# EAGLE design 404_led_matrix (EAGLE 9.6.2)
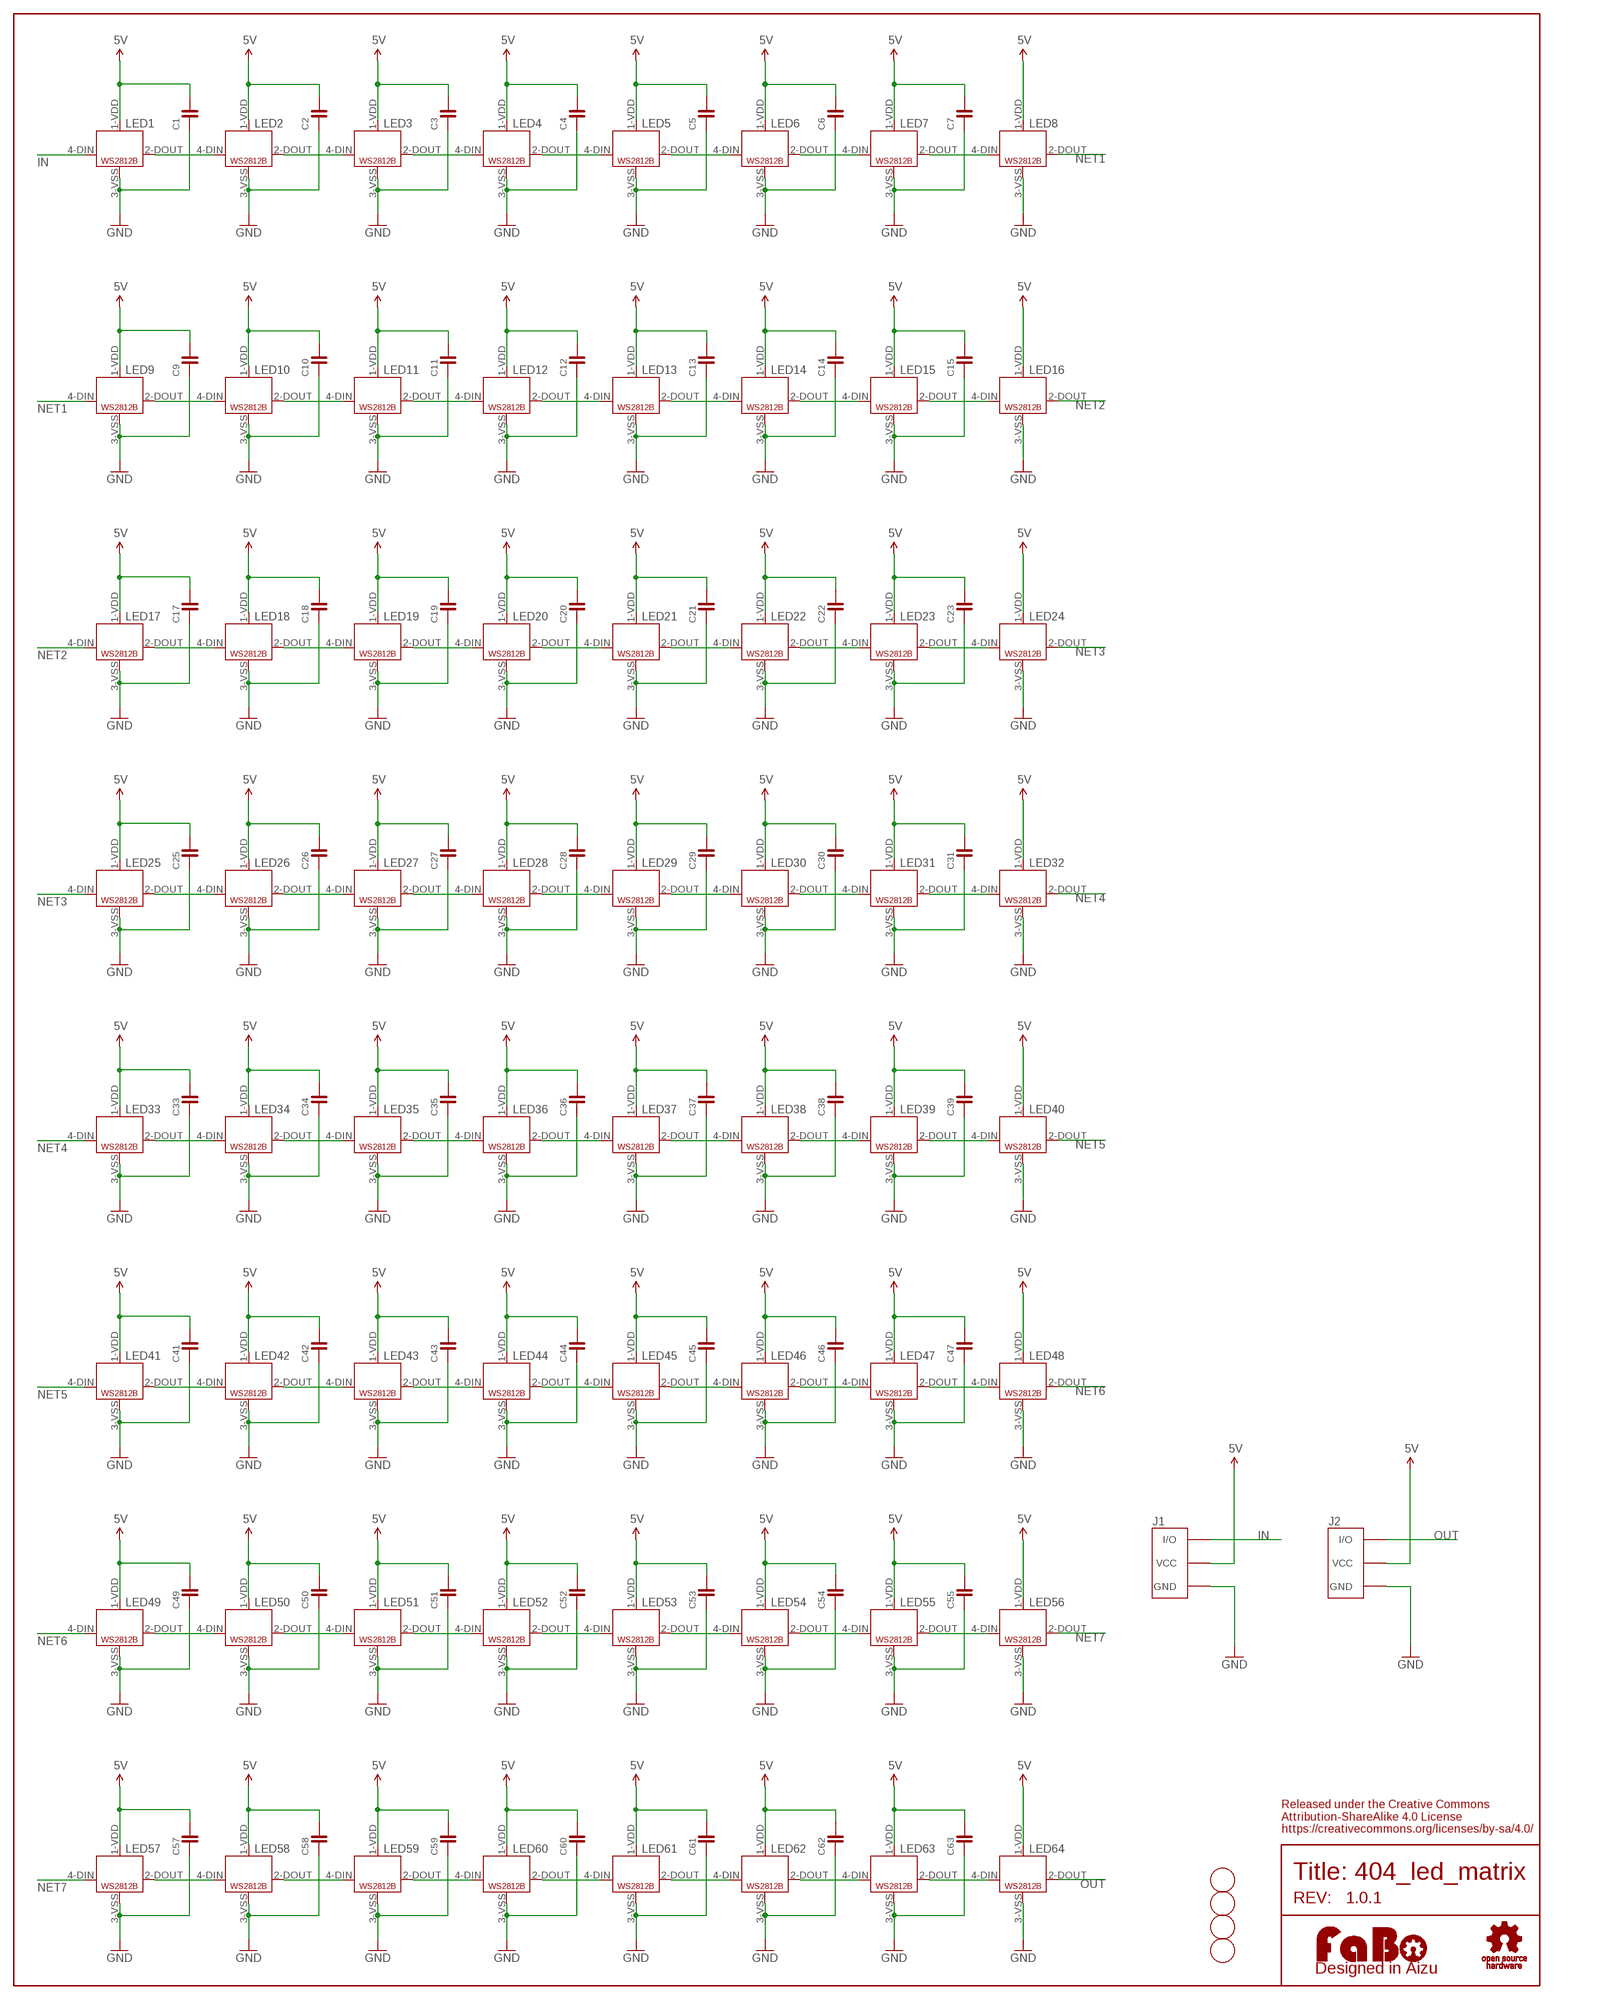
[diagram p0: schematic, sheet 1]

## Parts
C1  CAPACITOR-0603  [0603]
C2  CAPACITOR-0603  [0603]
C3  CAPACITOR-0603  [0603]
C4  CAPACITOR-0603  [0603]
C5  CAPACITOR-0603  [0603]
C6  CAPACITOR-0603  [0603]
C7  CAPACITOR-0603  [0603]
C9  CAPACITOR-0603  [0603]
C10  CAPACITOR-0603  [0603]
C11  CAPACITOR-0603  [0603]
C12  CAPACITOR-0603  [0603]
C13  CAPACITOR-0603  [0603]
C14  CAPACITOR-0603  [0603]
C15  CAPACITOR-0603  [0603]
C17  CAPACITOR-0603  [0603]
C18  CAPACITOR-0603  [0603]
C19  CAPACITOR-0603  [0603]
C20  CAPACITOR-0603  [0603]
C21  CAPACITOR-0603  [0603]
C22  CAPACITOR-0603  [0603]
C23  CAPACITOR-0603  [0603]
C25  CAPACITOR-0603  [0603]
C26  CAPACITOR-0603  [0603]
C27  CAPACITOR-0603  [0603]
C28  CAPACITOR-0603  [0603]
C29  CAPACITOR-0603  [0603]
C30  CAPACITOR-0603  [0603]
C31  CAPACITOR-0603  [0603]
C33  CAPACITOR-0603  [0603]
C34  CAPACITOR-0603  [0603]
C35  CAPACITOR-0603  [0603]
C36  CAPACITOR-0603  [0603]
C37  CAPACITOR-0603  [0603]
C38  CAPACITOR-0603  [0603]
C39  CAPACITOR-0603  [0603]
C41  CAPACITOR-0603  [0603]
C42  CAPACITOR-0603  [0603]
C43  CAPACITOR-0603  [0603]
C44  CAPACITOR-0603  [0603]
C45  CAPACITOR-0603  [0603]
C46  CAPACITOR-0603  [0603]
C47  CAPACITOR-0603  [0603]
C49  CAPACITOR-0603  [0603]
C50  CAPACITOR-0603  [0603]
C51  CAPACITOR-0603  [0603]
C52  CAPACITOR-0603  [0603]
C53  CAPACITOR-0603  [0603]
C54  CAPACITOR-0603  [0603]
C55  CAPACITOR-0603  [0603]
C57  CAPACITOR-0603  [0603]
C58  CAPACITOR-0603  [0603]
C59  CAPACITOR-0603  [0603]
C60  CAPACITOR-0603  [0603]
C61  CAPACITOR-0603  [0603]
C62  CAPACITOR-0603  [0603]
C63  CAPACITOR-0603  [0603]
HOLE1  SCREW-PAD-2.8MM  [SCREWPAD_2.8MM]
HOLE2  SCREW-PAD-2.8MM  [SCREWPAD_2.8MM]
HOLE3  SCREW-PAD-2.8MM  [SCREWPAD_2.8MM]
HOLE4  SCREW-PAD-2.8MM  [SCREWPAD_2.8MM]
J1  FABO_BRICK_3PIN-S03B-PASK-2  [FABO_BRICK_3PIN_S03B-PASK-2]
J2  FABO_BRICK_3PIN-S03B-PASK-2  [FABO_BRICK_3PIN_S03B-PASK-2]
LED1  WS2812B_NARROW  [WS2812B_NARROW]
LED2  WS2812B_NARROW  [WS2812B_NARROW]
LED3  WS2812B_NARROW  [WS2812B_NARROW]
LED4  WS2812B_NARROW  [WS2812B_NARROW]
LED5  WS2812B_NARROW  [WS2812B_NARROW]
LED6  WS2812B_NARROW  [WS2812B_NARROW]
LED7  WS2812B_NARROW  [WS2812B_NARROW]
LED8  WS2812B_NARROW  [WS2812B_NARROW]
LED9  WS2812B_NARROW  [WS2812B_NARROW]
LED10  WS2812B_NARROW  [WS2812B_NARROW]
LED11  WS2812B_NARROW  [WS2812B_NARROW]
LED12  WS2812B_NARROW  [WS2812B_NARROW]
LED13  WS2812B_NARROW  [WS2812B_NARROW]
LED14  WS2812B_NARROW  [WS2812B_NARROW]
LED15  WS2812B_NARROW  [WS2812B_NARROW]
LED16  WS2812B_NARROW  [WS2812B_NARROW]
LED17  WS2812B_NARROW  [WS2812B_NARROW]
LED18  WS2812B_NARROW  [WS2812B_NARROW]
LED19  WS2812B_NARROW  [WS2812B_NARROW]
LED20  WS2812B_NARROW  [WS2812B_NARROW]
LED21  WS2812B_NARROW  [WS2812B_NARROW]
LED22  WS2812B_NARROW  [WS2812B_NARROW]
LED23  WS2812B_NARROW  [WS2812B_NARROW]
LED24  WS2812B_NARROW  [WS2812B_NARROW]
LED25  WS2812B_NARROW  [WS2812B_NARROW]
LED26  WS2812B_NARROW  [WS2812B_NARROW]
LED27  WS2812B_NARROW  [WS2812B_NARROW]
LED28  WS2812B_NARROW  [WS2812B_NARROW]
LED29  WS2812B_NARROW  [WS2812B_NARROW]
LED30  WS2812B_NARROW  [WS2812B_NARROW]
LED31  WS2812B_NARROW  [WS2812B_NARROW]
LED32  WS2812B_NARROW  [WS2812B_NARROW]
LED33  WS2812B_NARROW  [WS2812B_NARROW]
LED34  WS2812B_NARROW  [WS2812B_NARROW]
LED35  WS2812B_NARROW  [WS2812B_NARROW]
LED36  WS2812B_NARROW  [WS2812B_NARROW]
LED37  WS2812B_NARROW  [WS2812B_NARROW]
LED38  WS2812B_NARROW  [WS2812B_NARROW]
LED39  WS2812B_NARROW  [WS2812B_NARROW]
LED40  WS2812B_NARROW  [WS2812B_NARROW]
LED41  WS2812B_NARROW  [WS2812B_NARROW]
LED42  WS2812B_NARROW  [WS2812B_NARROW]
LED43  WS2812B_NARROW  [WS2812B_NARROW]
LED44  WS2812B_NARROW  [WS2812B_NARROW]
LED45  WS2812B_NARROW  [WS2812B_NARROW]
LED46  WS2812B_NARROW  [WS2812B_NARROW]
LED47  WS2812B_NARROW  [WS2812B_NARROW]
LED48  WS2812B_NARROW  [WS2812B_NARROW]
LED49  WS2812B_NARROW  [WS2812B_NARROW]
LED50  WS2812B_NARROW  [WS2812B_NARROW]
LED51  WS2812B_NARROW  [WS2812B_NARROW]
LED52  WS2812B_NARROW  [WS2812B_NARROW]
LED53  WS2812B_NARROW  [WS2812B_NARROW]
LED54  WS2812B_NARROW  [WS2812B_NARROW]
LED55  WS2812B_NARROW  [WS2812B_NARROW]
LED56  WS2812B_NARROW  [WS2812B_NARROW]
LED57  WS2812B_NARROW  [WS2812B_NARROW]
LED58  WS2812B_NARROW  [WS2812B_NARROW]
LED59  WS2812B_NARROW  [WS2812B_NARROW]
LED60  WS2812B_NARROW  [WS2812B_NARROW]
LED61  WS2812B_NARROW  [WS2812B_NARROW]
LED62  WS2812B_NARROW  [WS2812B_NARROW]
LED63  WS2812B_NARROW  [WS2812B_NARROW]
LED64  WS2812B_NARROW  [WS2812B_NARROW]
LOGO1  LOGO_FABO-L_BOTTOM  [LOGO_FABO_L_BOTTOM]
U$1  LOGO_OSHW-M_BOTTOM  [LOGO_OSHW_M_BOTTOM]

## Nets
5V: C1.2 C2.2 C3.2 C4.2 C5.2 C6.2 C7.2 C9.2 C10.2 C11.2 C12.2 C13.2 C14.2 C15.2 C17.2 C18.2 C19.2 C20.2 C21.2 C22.2 C23.2 C25.2 C26.2 C27.2 C28.2 C29.2 C30.2 C31.2 C33.2 C34.2 C35.2 C36.2 C37.2 C38.2 C39.2 C41.2 C42.2 C43.2 C44.2 C45.2 C46.2 C47.2 C49.2 C50.2 C51.2 C52.2 C53.2 C54.2 C55.2 C57.2 C58.2 C59.2 C60.2 C61.2 C62.2 C63.2 J1.VCC J2.VCC LED1.1-VDD(VDD) LED2.1-VDD(VDD) LED3.1-VDD(VDD) LED4.1-VDD(VDD) LED5.1-VDD(VDD) LED6.1-VDD(VDD) LED7.1-VDD(VDD) LED8.1-VDD(VDD) LED9.1-VDD(VDD) LED10.1-VDD(VDD) LED11.1-VDD(VDD) LED12.1-VDD(VDD) LED13.1-VDD(VDD) LED14.1-VDD(VDD) LED15.1-VDD(VDD) LED16.1-VDD(VDD) LED17.1-VDD(VDD) LED18.1-VDD(VDD) LED19.1-VDD(VDD) LED20.1-VDD(VDD) LED21.1-VDD(VDD) LED22.1-VDD(VDD) LED23.1-VDD(VDD) LED24.1-VDD(VDD) LED25.1-VDD(VDD) LED26.1-VDD(VDD) LED27.1-VDD(VDD) LED28.1-VDD(VDD) LED29.1-VDD(VDD) LED30.1-VDD(VDD) LED31.1-VDD(VDD) LED32.1-VDD(VDD) LED33.1-VDD(VDD) LED34.1-VDD(VDD) LED35.1-VDD(VDD) LED36.1-VDD(VDD) LED37.1-VDD(VDD) LED38.1-VDD(VDD) LED39.1-VDD(VDD) LED40.1-VDD(VDD) LED41.1-VDD(VDD) LED42.1-VDD(VDD) LED43.1-VDD(VDD) LED44.1-VDD(VDD) LED45.1-VDD(VDD) LED46.1-VDD(VDD) LED47.1-VDD(VDD) LED48.1-VDD(VDD) LED49.1-VDD(VDD) LED50.1-VDD(VDD) LED51.1-VDD(VDD) LED52.1-VDD(VDD) LED53.1-VDD(VDD) LED54.1-VDD(VDD) LED55.1-VDD(VDD) LED56.1-VDD(VDD) LED57.1-VDD(VDD) LED58.1-VDD(VDD) LED59.1-VDD(VDD) LED60.1-VDD(VDD) LED61.1-VDD(VDD) LED62.1-VDD(VDD) LED63.1-VDD(VDD) LED64.1-VDD(VDD)
GND: C1.1 C2.1 C3.1 C4.1 C5.1 C6.1 C7.1 C9.1 C10.1 C11.1 C12.1 C13.1 C14.1 C15.1 C17.1 C18.1 C19.1 C20.1 C21.1 C22.1 C23.1 C25.1 C26.1 C27.1 C28.1 C29.1 C30.1 C31.1 C33.1 C34.1 C35.1 C36.1 C37.1 C38.1 C39.1 C41.1 C42.1 C43.1 C44.1 C45.1 C46.1 C47.1 C49.1 C50.1 C51.1 C52.1 C53.1 C54.1 C55.1 C57.1 C58.1 C59.1 C60.1 C61.1 C62.1 C63.1 J1.GND J2.GND LED1.3-VSS(VSS) LED2.3-VSS(VSS) LED3.3-VSS(VSS) LED4.3-VSS(VSS) LED5.3-VSS(VSS) LED6.3-VSS(VSS) LED7.3-VSS(VSS) LED8.3-VSS(VSS) LED9.3-VSS(VSS) LED10.3-VSS(VSS) LED11.3-VSS(VSS) LED12.3-VSS(VSS) LED13.3-VSS(VSS) LED14.3-VSS(VSS) LED15.3-VSS(VSS) LED16.3-VSS(VSS) LED17.3-VSS(VSS) LED18.3-VSS(VSS) LED19.3-VSS(VSS) LED20.3-VSS(VSS) LED21.3-VSS(VSS) LED22.3-VSS(VSS) LED23.3-VSS(VSS) LED24.3-VSS(VSS) LED25.3-VSS(VSS) LED26.3-VSS(VSS) LED27.3-VSS(VSS) LED28.3-VSS(VSS) LED29.3-VSS(VSS) LED30.3-VSS(VSS) LED31.3-VSS(VSS) LED32.3-VSS(VSS) LED33.3-VSS(VSS) LED34.3-VSS(VSS) LED35.3-VSS(VSS) LED36.3-VSS(VSS) LED37.3-VSS(VSS) LED38.3-VSS(VSS) LED39.3-VSS(VSS) LED40.3-VSS(VSS) LED41.3-VSS(VSS) LED42.3-VSS(VSS) LED43.3-VSS(VSS) LED44.3-VSS(VSS) LED45.3-VSS(VSS) LED46.3-VSS(VSS) LED47.3-VSS(VSS) LED48.3-VSS(VSS) LED49.3-VSS(VSS) LED50.3-VSS(VSS) LED51.3-VSS(VSS) LED52.3-VSS(VSS) LED53.3-VSS(VSS) LED54.3-VSS(VSS) LED55.3-VSS(VSS) LED56.3-VSS(VSS) LED57.3-VSS(VSS) LED58.3-VSS(VSS) LED59.3-VSS(VSS) LED60.3-VSS(VSS) LED61.3-VSS(VSS) LED62.3-VSS(VSS) LED63.3-VSS(VSS) LED64.3-VSS(VSS)
IN: J1.I/O LED1.4-DIN(DIN)
N$1: LED3.2-DOUT(DOUT) LED4.4-DIN(DIN)
N$2: LED4.2-DOUT(DOUT) LED5.4-DIN(DIN)
N$3: LED5.2-DOUT(DOUT) LED6.4-DIN(DIN)
N$4: LED6.2-DOUT(DOUT) LED7.4-DIN(DIN)
N$5: LED1.2-DOUT(DOUT) LED2.4-DIN(DIN)
N$6: LED7.2-DOUT(DOUT) LED8.4-DIN(DIN)
N$7: LED9.2-DOUT(DOUT) LED10.4-DIN(DIN)
N$8: LED10.2-DOUT(DOUT) LED11.4-DIN(DIN)
N$9: LED11.2-DOUT(DOUT) LED12.4-DIN(DIN)
N$10: LED12.2-DOUT(DOUT) LED13.4-DIN(DIN)
N$11: LED13.2-DOUT(DOUT) LED14.4-DIN(DIN)
N$12: LED14.2-DOUT(DOUT) LED15.4-DIN(DIN)
N$13: LED15.2-DOUT(DOUT) LED16.4-DIN(DIN)
N$14: LED17.2-DOUT(DOUT) LED18.4-DIN(DIN)
N$15: LED18.2-DOUT(DOUT) LED19.4-DIN(DIN)
N$16: LED19.2-DOUT(DOUT) LED20.4-DIN(DIN)
N$17: LED20.2-DOUT(DOUT) LED21.4-DIN(DIN)
N$18: LED21.2-DOUT(DOUT) LED22.4-DIN(DIN)
N$19: LED22.2-DOUT(DOUT) LED23.4-DIN(DIN)
N$20: LED23.2-DOUT(DOUT) LED24.4-DIN(DIN)
N$21: LED25.2-DOUT(DOUT) LED26.4-DIN(DIN)
N$22: LED26.2-DOUT(DOUT) LED27.4-DIN(DIN)
N$23: LED27.2-DOUT(DOUT) LED28.4-DIN(DIN)
N$24: LED28.2-DOUT(DOUT) LED29.4-DIN(DIN)
N$25: LED29.2-DOUT(DOUT) LED30.4-DIN(DIN)
N$26: LED30.2-DOUT(DOUT) LED31.4-DIN(DIN)
N$27: LED31.2-DOUT(DOUT) LED32.4-DIN(DIN)
N$28: LED33.2-DOUT(DOUT) LED34.4-DIN(DIN)
N$29: LED34.2-DOUT(DOUT) LED35.4-DIN(DIN)
N$30: LED35.2-DOUT(DOUT) LED36.4-DIN(DIN)
N$31: LED36.2-DOUT(DOUT) LED37.4-DIN(DIN)
N$32: LED37.2-DOUT(DOUT) LED38.4-DIN(DIN)
N$33: LED38.2-DOUT(DOUT) LED39.4-DIN(DIN)
N$34: LED39.2-DOUT(DOUT) LED40.4-DIN(DIN)
N$35: LED41.2-DOUT(DOUT) LED42.4-DIN(DIN)
N$36: LED42.2-DOUT(DOUT) LED43.4-DIN(DIN)
N$37: LED43.2-DOUT(DOUT) LED44.4-DIN(DIN)
N$38: LED44.2-DOUT(DOUT) LED45.4-DIN(DIN)
N$39: LED45.2-DOUT(DOUT) LED46.4-DIN(DIN)
N$40: LED46.2-DOUT(DOUT) LED47.4-DIN(DIN)
N$41: LED47.2-DOUT(DOUT) LED48.4-DIN(DIN)
N$42: LED49.2-DOUT(DOUT) LED50.4-DIN(DIN)
N$43: LED50.2-DOUT(DOUT) LED51.4-DIN(DIN)
N$44: LED51.2-DOUT(DOUT) LED52.4-DIN(DIN)
N$45: LED52.2-DOUT(DOUT) LED53.4-DIN(DIN)
N$46: LED53.2-DOUT(DOUT) LED54.4-DIN(DIN)
N$47: LED54.2-DOUT(DOUT) LED55.4-DIN(DIN)
N$48: LED55.2-DOUT(DOUT) LED56.4-DIN(DIN)
N$49: LED57.2-DOUT(DOUT) LED58.4-DIN(DIN)
N$50: LED58.2-DOUT(DOUT) LED59.4-DIN(DIN)
N$51: LED59.2-DOUT(DOUT) LED60.4-DIN(DIN)
N$52: LED60.2-DOUT(DOUT) LED61.4-DIN(DIN)
N$53: LED61.2-DOUT(DOUT) LED62.4-DIN(DIN)
N$54: LED62.2-DOUT(DOUT) LED63.4-DIN(DIN)
N$55: LED63.2-DOUT(DOUT) LED64.4-DIN(DIN)
N$60: LED2.2-DOUT(DOUT) LED3.4-DIN(DIN)
NET1: LED8.2-DOUT(DOUT) LED9.4-DIN(DIN)
NET2: LED16.2-DOUT(DOUT) LED17.4-DIN(DIN)
NET3: LED24.2-DOUT(DOUT) LED25.4-DIN(DIN)
NET4: LED32.2-DOUT(DOUT) LED33.4-DIN(DIN)
NET5: LED40.2-DOUT(DOUT) LED41.4-DIN(DIN)
NET6: LED48.2-DOUT(DOUT) LED49.4-DIN(DIN)
NET7: LED56.2-DOUT(DOUT) LED57.4-DIN(DIN)
OUT: J2.I/O LED64.2-DOUT(DOUT)

## Notes on the sheet
- Released under the Creative Commons
  Attribution-ShareAlike 4.0 License
  https://creativecommons.org/licenses/by-sa/4.0/
- Title: 404_led_matrix
- REV: | 1.0.1

## Library data of the parts
C1-C7 C9-C15 C17-C23 C25-C31 C33-C39 C41-C47 C49-C55 C57-C63 = FaBo-Capacitor:CAPACITOR: CAPACITOR
HOLE1-HOLE4 = FaBo-etc:SCREW-PAD
J1 J2 = FaBo-Template:FABO_BRICK_3PIN: FaBo Brick 3pin
LED1-LED64 = FaBo-LED:WS2812B_NARROW
LOGO1 = component:LOGO_FABO
U$1 = FaBo-etc:LOGO_OSHW

## Board
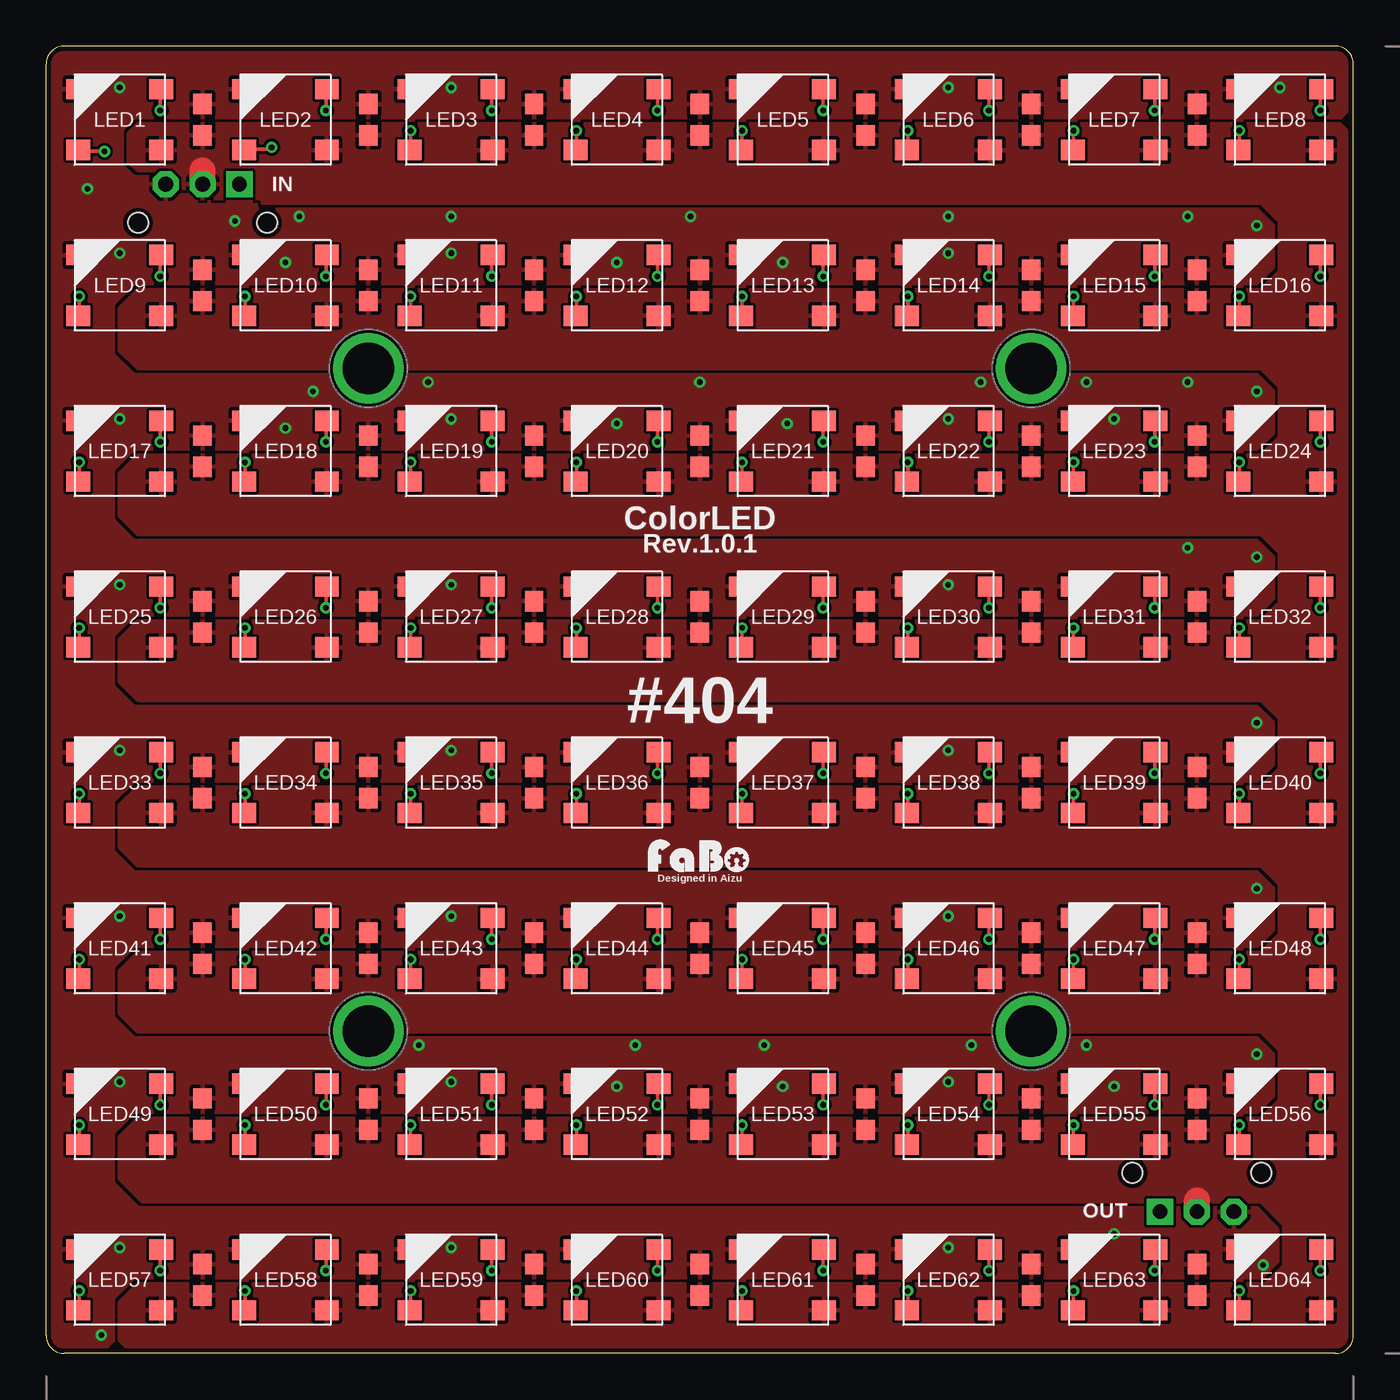
[diagram p1: board, top side]
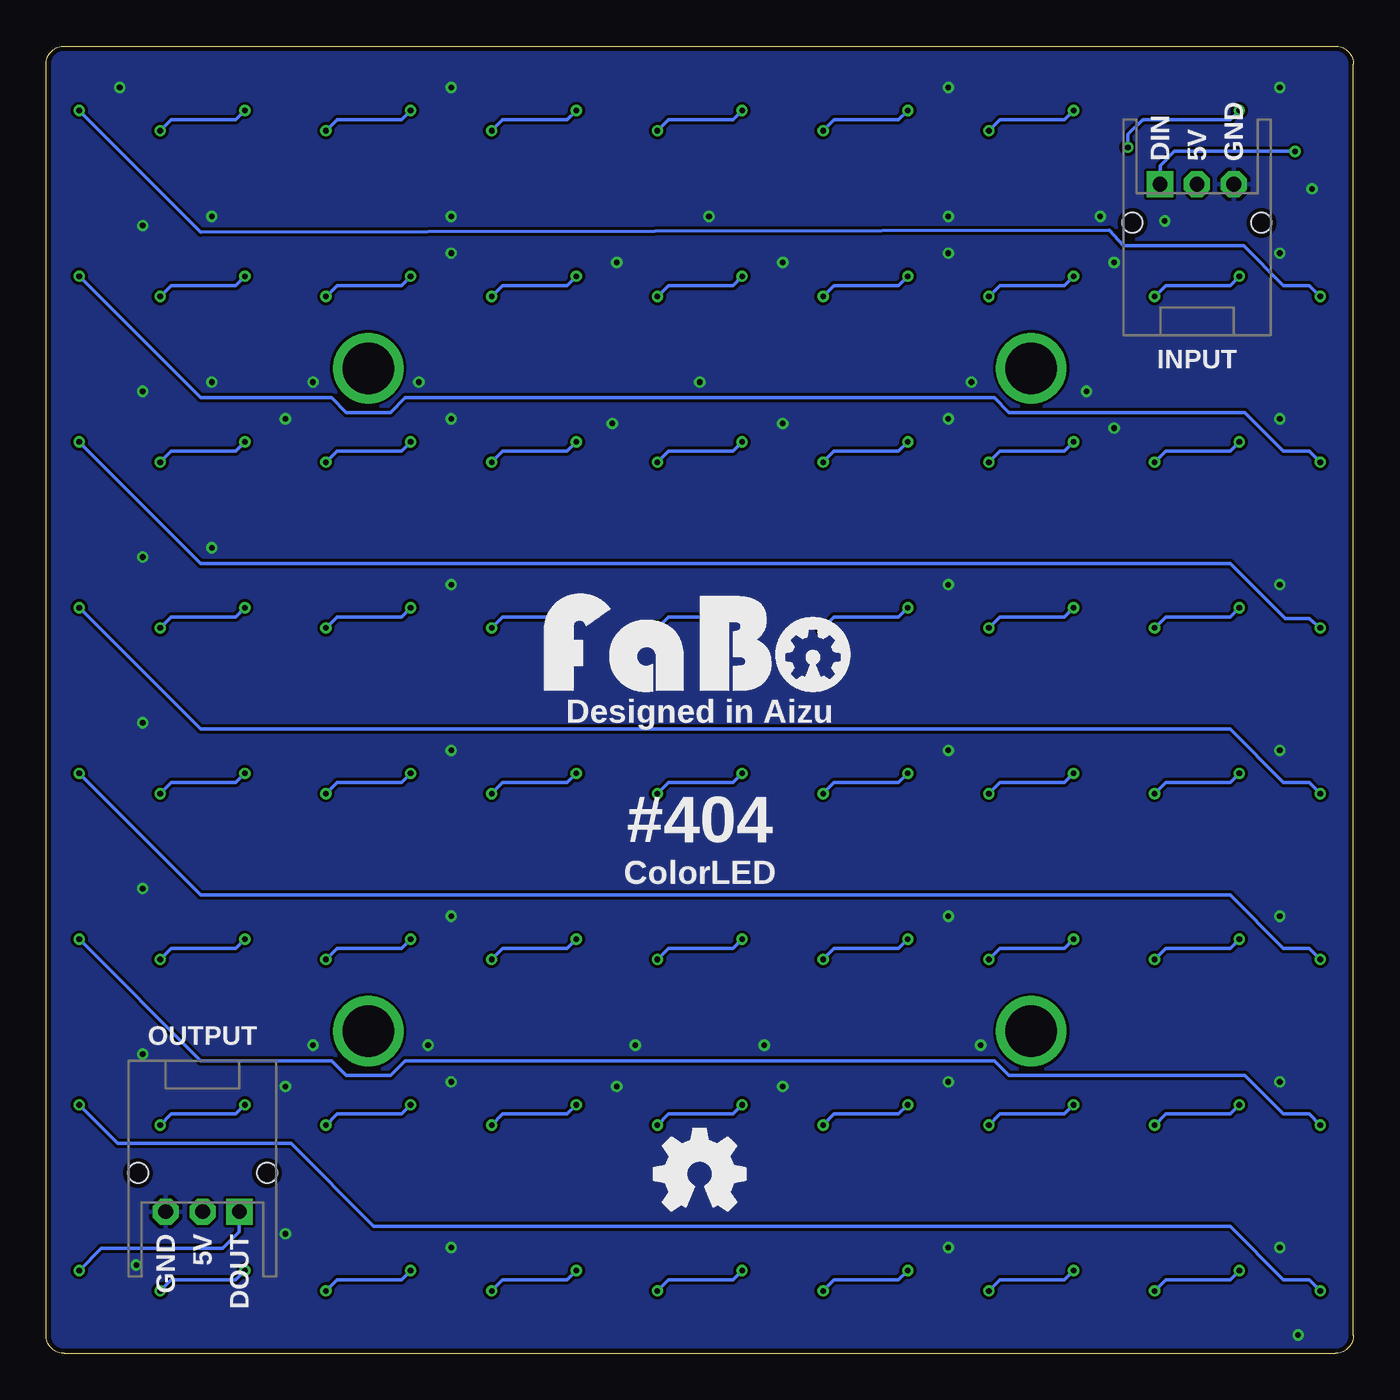
[diagram p2: board, bottom side, seen from below]

Size 71 x 71 mm. Coordinates in mm from the lower left corner, seen from the top.
Outline: 71,1 71,70 arc90 70,71 1,71 arc90 0,70 0,1 arc90 1,0 70,0 arc90 71,1
Copper layers (1*16): Top 0.035mm / dielectric 1.6mm / Bottom 0.035mm
Design rules "PCBway": minimum track width 6mil, minimum drill 12mil, track to track 6mil, track to pad 6mil, pad to pad 6mil, via to via 6mil, smd to smd 6mil, copper to edge 10mil, drill to drill 10mil, minimum pad ring 10mil, minimum via ring 6mil, stop-mask expansion 2mil, vias tented up to drill 100mil, thermal gap 8mil
tRestrict: area 3.5,0.2 to 3.8,0.5; area 70.5,67 to 70.8,67.2

### Footprints (pad centres in the part's own frame; a part is rotated, then mirrored left to right if it is on the bottom)
0603 = smd 1.1 x 1: 1 -0.85,0; 2 0.85,0
SCREWPAD_2.8MM = drill 2.8 pad 3.1: 1 0,0
FABO_BRICK_3PIN_S03B-PASK-2 = drill 0.8 pad 1.422 octagon: GND -2,0; VCC 0,0 | drill 0.8 pad 1.422 square: I/O 2,0 | hole 1.1: 3.5,2.1; -3.5,2.1
WS2812B_NARROW = smd 1.3 x 1.1: 1-VDD -2.25,1.65; 2-DOUT -2.25,-1.65; 3-VSS 2.25,-1.65; 4-DIN 2.25,1.65

### Placement (x,y rotation side)
C1  8.5,67 270 top
C2  17.5,67 270 top
C3  26.5,67 270 top
C4  35.5,67 270 top
C5  44.5,67 270 top
C6  53.5,67 270 top
C7  62.5,67 270 top
C9  8.5,58 270 top
C10  17.5,58 270 top
C11  26.5,58 270 top
C12  35.5,58 270 top
C13  44.5,58 270 top
C14  53.5,58 270 top
C15  62.5,58 270 top
C17  8.5,49 270 top
C18  17.5,49 270 top
C19  26.5,49 270 top
C20  35.5,49 270 top
C21  44.5,49 270 top
C22  53.5,49 270 top
C23  62.5,49 270 top
C25  8.5,40 270 top
C26  17.5,40 270 top
C27  26.5,40 270 top
C28  35.5,40 270 top
C29  44.5,40 270 top
C30  53.5,40 270 top
C31  62.5,40 270 top
C33  8.5,31 270 top
C34  17.5,31 270 top
C35  26.5,31 270 top
C36  35.5,31 270 top
C37  44.5,31 270 top
C38  53.5,31 270 top
C39  62.5,31 270 top
C41  8.5,22 270 top
C42  17.5,22 270 top
C43  26.5,22 270 top
C44  35.5,22 270 top
C45  44.5,22 270 top
C46  53.5,22 270 top
C47  62.5,22 270 top
C49  8.5,13 270 top
C50  17.5,13 270 top
C51  26.5,13 270 top
C52  35.5,13 270 top
C53  44.5,13 270 top
C54  53.5,13 270 top
C55  62.5,13 270 top
C57  8.5,4 270 top
C58  17.5,4 270 top
C59  26.5,4 270 top
C60  35.5,4 270 top
C61  44.5,4 270 top
C62  53.5,4 270 top
C63  62.5,4 270 top
HOLE1  17.5,17.5 0 top
HOLE2  17.5,53.5 0 top
HOLE3  53.5,53.5 0 top
HOLE4  53.5,17.5 0 top
J1  8.5,63.5 180 bottom
J2  62.5,7.7 0 bottom
LED1  4,67 180 top
LED2  13,67 180 top
LED3  22,67 180 top
LED4  31,67 180 top
LED5  40,67 180 top
LED6  49,67 180 top
LED7  58,67 180 top
LED8  67,67 180 top
LED9  4,58 180 top
LED10  13,58 180 top
LED11  22,58 180 top
LED12  31,58 180 top
LED13  40,58 180 top
LED14  49,58 180 top
LED15  58,58 180 top
LED16  67,58 180 top
LED17  4,49 180 top
LED18  13,49 180 top
LED19  22,49 180 top
LED20  31,49 180 top
LED21  40,49 180 top
LED22  49,49 180 top
LED23  58,49 180 top
LED24  67,49 180 top
LED25  4,40 180 top
LED26  13,40 180 top
LED27  22,40 180 top
LED28  31,40 180 top
LED29  40,40 180 top
LED30  49,40 180 top
LED31  58,40 180 top
LED32  67,40 180 top
LED33  4,31 180 top
LED34  13,31 180 top
LED35  22,31 180 top
LED36  31,31 180 top
LED37  40,31 180 top
LED38  49,31 180 top
LED39  58,31 180 top
LED40  67,31 180 top
LED41  4,22 180 top
LED42  13,22 180 top
LED43  22,22 180 top
LED44  31,22 180 top
LED45  40,22 180 top
LED46  49,22 180 top
LED47  58,22 180 top
LED48  67,22 180 top
LED49  4,13 180 top
LED50  13,13 180 top
LED51  22,13 180 top
LED52  31,13 180 top
LED53  40,13 180 top
LED54  49,13 180 top
LED55  58,13 180 top
LED56  67,13 180 top
LED57  4,4 180 top
LED58  13,4 180 top
LED59  22,4 180 top
LED60  31,4 180 top
LED61  40,4 180 top
LED62  49,4 180 top
LED63  58,4 180 top
LED64  67,4 180 top
LOGO1  35.5,35.5 0 top
U$1  35.5,9.75 0 top
U$2  [LOGO_FABO_S]  35.5,26 0 top

### Tracks (layer width: path | path; a pad name or v marks a point on that pad's centre or on a via)
5V
  Top 1.422: J2.VCC 62.5,8.3 | J1.VCC 8.5,64.25
  pour Top: 4.5,64.75 4.5,66.25 5,66.75 70.25,66.75 71,66 71,0 4.75,0 4,0.75 4,2.75 5,3.75 66.25,3.75 67.25,4.75 67.25,7 66,8.25 5.25,8.25 4,9.5 4,11.75 5,12.75 66,12.75 67,13.75 67,16.5 66,17.5 5,17.5 4,18.5 4,20.75 5,21.75 66,21.75 67,22.75 67,25.5 66,26.5 5,26.5 4,27.5 4,29.75 5,30.75 66,30.75 67,31.75 67,34.5 66,35.5 5,35.5 4,36.5 4,38.75 5,39.75 66,39.75 67,40.75 67,43.5 66,44.5 5,44.5 4,45.5 4,47.75 5,48.75 66,48.75 67,49.75 67,52.5 66,53.5 5,53.5 4,54.5 4,56.75 5,57.75 66,57.75 67,58.75 67,61.5 66,62.5 11.75,62.5 11.75,62.75 8,62.75 7.25,63.5 7.25,63.75 6.75,64.25 5,64.25
GND  (via drill 0.3)
  other vias: 67,68.75 4,68.75 65.75,52.25 4,59.75 4,50.75 4,41.75 4,32.75 4,23.75 4,14.75 4,5.75 65.75,34.25 65.75,43.25 65.75,61.25 65.75,25.25 65.75,16.25 22,68.75 49,68.75 3,1 49,59.75 49,50.75 49,41.75 49,32.75 49,23.75 49,14.75 49,5.75 22,59.75 22,50.75 22,41.75 22,32.75 22,23.75 22,14.75 22,5.75 66.1,4.8 13.75,61.75 22,61.75 10.25,61.5 49,61.75 62,61.75 13,59.25 2.25,63.25 14.5,52.25 20.75,52.75 13,50.25 50.75,52.75 35.5,52.75 31,50.5 40.25,50.5 62,52.75 56.5,52.75 58,50.75 62,43.75 35,61.75 40,59.25 31,59.25 56.5,16.75 50.25,16.75 58,14.5 20.25,16.75 32,16.75 39,16.75 40,14.5 31,14.5 58,6.5
  pour Bottom (rank 2): 0,71 71,71 71,0 0,0
  pour Top (rank 2): 0,71 71,71 71,0 0,0
IN  (via drill 0.3)
  Top 0.203: LED1.4-DIN 2.29,65.35 2.29,65.28 v3.17,65.28
  Bottom 0.203: v3.17,65.28 9.72,65.28 10.5,64.5 J1.I/O
N$1  (via drill 0.3)
  Top 0.203: LED3.2-DOUT 24.2,68.6 v24.2,67.5 | LED4.4-DIN 28.8,65.4 v28.8,66.4
  Bottom 0.203: v24.2,67.5 24.7,67 28.2,67 v28.8,66.4
N$2  (via drill 0.3)
  Top 0.203: LED4.2-DOUT 33.2,68.6 v33.2,67.5 | LED5.4-DIN 37.8,65.4 v37.8,66.4
  Bottom 0.203: v33.2,67.5 33.7,67 37.2,67 v37.8,66.4
N$3  (via drill 0.3)
  Top 0.203: LED5.2-DOUT 42.2,68.6 v42.2,67.5 | LED6.4-DIN 46.8,65.4 v46.8,66.4
  Bottom 0.203: v42.2,67.5 42.7,67 46.2,67 v46.8,66.4
N$4  (via drill 0.3)
  Top 0.203: LED6.2-DOUT 51.2,68.6 v51.2,67.5 | LED7.4-DIN 55.8,65.4 v55.8,66.4
  Bottom 0.203: v51.2,67.5 51.7,67 55.2,67 v55.8,66.4
N$5  (via drill 0.3)
  Top 0.203: LED1.2-DOUT 6.2,68.6 v6.2,67.5 | LED2.4-DIN 10.8,65.4 12.15,65.4 v12.25,65.5
  Bottom 0.203: v6.2,67.5 6.7,67 11.45,67 12.25,66.2 v12.25,65.5
N$6  (via drill 0.3)
  Top 0.203: LED7.2-DOUT 60.2,68.6 v60.2,67.5 | LED8.4-DIN 64.8,65.4 v64.8,66.4
  Bottom 0.203: v60.2,67.5 60.7,67 64.2,67 v64.8,66.4
N$7  (via drill 0.3)
  Top 0.203: LED9.2-DOUT 6.2,59.6 v6.2,58.5 | LED10.4-DIN 10.8,56.4 v10.8,57.4
  Bottom 0.203: v6.2,58.5 6.7,58 10.2,58 v10.8,57.4
N$8  (via drill 0.3)
  Top 0.203: LED10.2-DOUT 15.2,59.6 v15.2,58.5 | LED11.4-DIN 19.8,56.4 v19.8,57.4
  Bottom 0.203: v15.2,58.5 15.7,58 19.2,58 v19.8,57.4
N$9  (via drill 0.3)
  Top 0.203: LED11.2-DOUT 24.2,59.6 v24.2,58.5 | LED12.4-DIN 28.8,56.4 v28.8,57.4
  Bottom 0.203: v24.2,58.5 24.7,58 28.2,58 v28.8,57.4
N$10  (via drill 0.3)
  Top 0.203: LED12.2-DOUT 33.2,59.6 v33.2,58.5 | LED13.4-DIN 37.8,56.4 v37.8,57.4
  Bottom 0.203: v33.2,58.5 33.7,58 37.2,58 v37.8,57.4
N$11  (via drill 0.3)
  Top 0.203: LED13.2-DOUT 42.2,59.6 v42.2,58.5 | LED14.4-DIN 46.8,56.4 v46.8,57.4
  Bottom 0.203: v42.2,58.5 42.7,58 46.2,58 v46.8,57.4
N$12  (via drill 0.3)
  Top 0.203: LED14.2-DOUT 51.2,59.6 v51.2,58.5 | LED15.4-DIN 55.8,56.4 v55.8,57.4
  Bottom 0.203: v51.2,58.5 51.7,58 55.2,58 v55.8,57.4
N$13  (via drill 0.3)
  Top 0.203: LED15.2-DOUT 60.2,59.6 v60.2,58.5 | LED16.4-DIN 64.8,56.4 v64.8,57.4
  Bottom 0.203: v60.2,58.5 60.7,58 64.2,58 v64.8,57.4
N$14  (via drill 0.3)
  Top 0.203: LED17.2-DOUT 6.2,50.6 v6.2,49.5 | LED18.4-DIN 10.8,47.4 v10.8,48.4
  Bottom 0.203: v6.2,49.5 6.7,49 10.2,49 v10.8,48.4
N$15  (via drill 0.3)
  Top 0.203: LED18.2-DOUT 15.2,50.6 v15.2,49.5 | LED19.4-DIN 19.8,47.4 v19.8,48.4
  Bottom 0.203: v15.2,49.5 15.7,49 19.2,49 v19.8,48.4
N$16  (via drill 0.3)
  Top 0.203: LED19.2-DOUT 24.2,50.6 v24.2,49.5 | LED20.4-DIN 28.8,47.4 v28.8,48.4
  Bottom 0.203: v24.2,49.5 24.7,49 28.2,49 v28.8,48.4
N$17  (via drill 0.3)
  Top 0.203: LED20.2-DOUT 33.2,50.6 v33.2,49.5 | LED21.4-DIN 37.8,47.4 v37.8,48.4
  Bottom 0.203: v33.2,49.5 33.7,49 37.2,49 v37.8,48.4
N$18  (via drill 0.3)
  Top 0.203: LED21.2-DOUT 42.2,50.6 v42.2,49.5 | LED22.4-DIN 46.8,47.4 v46.8,48.4
  Bottom 0.203: v42.2,49.5 42.7,49 46.2,49 v46.8,48.4
N$19  (via drill 0.3)
  Top 0.203: LED22.2-DOUT 51.2,50.6 v51.2,49.5 | LED23.4-DIN 55.8,47.4 v55.8,48.4
  Bottom 0.203: v51.2,49.5 51.7,49 55.2,49 v55.8,48.4
N$20  (via drill 0.3)
  Top 0.203: LED23.2-DOUT 60.2,50.6 v60.2,49.5 | LED24.4-DIN 64.8,47.4 v64.8,48.4
  Bottom 0.203: v60.2,49.5 60.7,49 64.2,49 v64.8,48.4
N$21  (via drill 0.3)
  Top 0.203: LED26.4-DIN 10.8,38.4 v10.8,39.4 | LED25.2-DOUT 6.2,41.6 v6.2,40.5
  Bottom 0.203: v10.8,39.4 10.2,40 6.7,40 v6.2,40.5
N$22  (via drill 0.3)
  Top 0.203: LED27.4-DIN 19.8,38.4 v19.8,39.4 | LED26.2-DOUT 15.2,41.6 v15.2,40.5
  Bottom 0.203: v19.8,39.4 19.2,40 15.7,40 v15.2,40.5
N$23  (via drill 0.3)
  Top 0.203: LED28.4-DIN 28.8,38.4 v28.8,39.4 | LED27.2-DOUT 24.2,41.6 v24.2,40.5
  Bottom 0.203: v28.8,39.4 28.2,40 24.7,40 v24.2,40.5
N$24  (via drill 0.3)
  Top 0.203: LED29.4-DIN 37.8,38.4 v37.8,39.4 | LED28.2-DOUT 33.2,41.6 v33.2,40.5
  Bottom 0.203: v37.8,39.4 37.2,40 33.7,40 v33.2,40.5
N$25  (via drill 0.3)
  Top 0.203: LED30.4-DIN 46.8,38.4 v46.8,39.4 | LED29.2-DOUT 42.2,41.6 v42.2,40.5
  Bottom 0.203: v46.8,39.4 46.2,40 42.7,40 v42.2,40.5
N$26  (via drill 0.3)
  Top 0.203: LED31.4-DIN 55.8,38.4 v55.8,39.4 | LED30.2-DOUT 51.2,41.6 v51.2,40.5
  Bottom 0.203: v55.8,39.4 55.2,40 51.7,40 v51.2,40.5
N$27  (via drill 0.3)
  Top 0.203: LED32.4-DIN 64.8,38.4 v64.8,39.4 | LED31.2-DOUT 60.2,41.6 v60.2,40.5
  Bottom 0.203: v64.8,39.4 64.2,40 60.7,40 v60.2,40.5
N$28  (via drill 0.3)
  Top 0.203: LED33.2-DOUT 6.2,32.6 v6.2,31.5 | LED34.4-DIN 10.8,29.4 v10.8,30.4
  Bottom 0.203: v6.2,31.5 6.7,31 10.2,31 v10.8,30.4
N$29  (via drill 0.3)
  Top 0.203: LED34.2-DOUT 15.2,32.6 v15.2,31.5 | LED35.4-DIN 19.8,29.4 v19.8,30.4
  Bottom 0.203: v15.2,31.5 15.7,31 19.2,31 v19.8,30.4
N$30  (via drill 0.3)
  Top 0.203: LED35.2-DOUT 24.2,32.6 v24.2,31.5 | LED36.4-DIN 28.8,29.4 v28.8,30.4
  Bottom 0.203: v24.2,31.5 24.7,31 28.2,31 v28.8,30.4
N$31  (via drill 0.3)
  Top 0.203: LED36.2-DOUT 33.2,32.6 v33.2,31.5 | LED37.4-DIN 37.8,29.4 v37.8,30.4
  Bottom 0.203: v33.2,31.5 33.7,31 37.2,31 v37.8,30.4
N$32  (via drill 0.3)
  Top 0.203: LED37.2-DOUT 42.2,32.6 v42.2,31.5 | LED38.4-DIN 46.8,29.4 v46.8,30.4
  Bottom 0.203: v42.2,31.5 42.7,31 46.2,31 v46.8,30.4
N$33  (via drill 0.3)
  Top 0.203: LED38.2-DOUT 51.2,32.6 v51.2,31.5 | LED39.4-DIN 55.8,29.4 v55.8,30.4
  Bottom 0.203: v51.2,31.5 51.7,31 55.2,31 v55.8,30.4
N$34  (via drill 0.3)
  Top 0.203: LED39.2-DOUT 60.2,32.6 v60.2,31.5 | LED40.4-DIN 64.8,29.4 v64.8,30.4
  Bottom 0.203: v60.2,31.5 60.7,31 64.2,31 v64.8,30.4
N$35  (via drill 0.3)
  Top 0.203: LED41.2-DOUT 6.2,23.6 v6.2,22.5 | LED42.4-DIN 10.8,20.4 v10.8,21.4
  Bottom 0.203: v6.2,22.5 6.7,22 10.2,22 v10.8,21.4
N$36  (via drill 0.3)
  Top 0.203: LED42.2-DOUT 15.2,23.6 v15.2,22.5 | LED43.4-DIN 19.8,20.4 v19.8,21.4
  Bottom 0.203: v15.2,22.5 15.7,22 19.2,22 v19.8,21.4
N$37  (via drill 0.3)
  Top 0.203: LED43.2-DOUT 24.2,23.6 v24.2,22.5 | LED44.4-DIN 28.8,20.4 v28.8,21.4
  Bottom 0.203: v24.2,22.5 24.7,22 28.2,22 v28.8,21.4
N$38  (via drill 0.3)
  Top 0.203: LED44.2-DOUT 33.2,23.6 v33.2,22.5 | LED45.4-DIN 37.8,20.4 v37.8,21.4
  Bottom 0.203: v33.2,22.5 33.7,22 37.2,22 v37.8,21.4
N$39  (via drill 0.3)
  Top 0.203: LED45.2-DOUT 42.2,23.6 v42.2,22.5 | LED46.4-DIN 46.8,20.4 v46.8,21.4
  Bottom 0.203: v42.2,22.5 42.7,22 46.2,22 v46.8,21.4
N$40  (via drill 0.3)
  Top 0.203: LED46.2-DOUT 51.2,23.6 v51.2,22.5 | LED47.4-DIN 55.8,20.4 v55.8,21.4
  Bottom 0.203: v51.2,22.5 51.7,22 55.2,22 v55.8,21.4
N$41  (via drill 0.3)
  Top 0.203: LED47.2-DOUT 60.2,23.6 v60.2,22.5 | LED48.4-DIN 64.8,20.4 v64.8,21.4
  Bottom 0.203: v60.2,22.5 60.7,22 64.2,22 v64.8,21.4
N$42  (via drill 0.3)
  Top 0.203: LED50.4-DIN 10.8,11.4 v10.8,12.4 | LED49.2-DOUT 6.2,14.6 v6.2,13.5
  Bottom 0.203: v10.8,12.4 10.2,13 6.7,13 v6.2,13.5
N$43  (via drill 0.3)
  Top 0.203: LED51.4-DIN 19.8,11.4 v19.8,12.4 | LED50.2-DOUT 15.2,14.6 v15.2,13.5
  Bottom 0.203: v19.8,12.4 19.2,13 15.7,13 v15.2,13.5
N$44  (via drill 0.3)
  Top 0.203: LED52.4-DIN 28.8,11.4 v28.8,12.4 | LED51.2-DOUT 24.2,14.6 v24.2,13.5
  Bottom 0.203: v28.8,12.4 28.2,13 24.7,13 v24.2,13.5
N$45  (via drill 0.3)
  Top 0.203: LED53.4-DIN 37.8,11.4 v37.8,12.4 | LED52.2-DOUT 33.2,14.6 v33.2,13.5
  Bottom 0.203: v37.8,12.4 37.2,13 33.7,13 v33.2,13.5
N$46  (via drill 0.3)
  Top 0.203: LED54.4-DIN 46.8,11.4 v46.8,12.4 | LED53.2-DOUT 42.2,14.6 v42.2,13.5
  Bottom 0.203: v46.8,12.4 46.2,13 42.7,13 v42.2,13.5
N$47  (via drill 0.3)
  Top 0.203: LED55.4-DIN 55.8,11.4 v55.8,12.4 | LED54.2-DOUT 51.2,14.6 v51.2,13.5
  Bottom 0.203: v55.8,12.4 55.2,13 51.7,13 v51.2,13.5
N$48  (via drill 0.3)
  Top 0.203: LED56.4-DIN 64.8,11.4 v64.8,12.4 | LED55.2-DOUT 60.2,14.6 v60.2,13.5
  Bottom 0.203: v64.8,12.4 64.2,13 60.7,13 v60.2,13.5
N$49  (via drill 0.3)
  Top 0.203: LED57.2-DOUT 6.2,5.6 v6.2,4.5 | LED58.4-DIN 10.8,2.4 v10.8,3.4
  Bottom 0.203: v6.2,4.5 6.7,4 10.2,4 v10.8,3.4
N$50  (via drill 0.3)
  Top 0.203: LED58.2-DOUT 15.2,5.6 v15.2,4.5 | LED59.4-DIN 19.8,2.4 v19.8,3.4
  Bottom 0.203: v15.2,4.5 15.7,4 19.2,4 v19.8,3.4
N$51  (via drill 0.3)
  Top 0.203: LED59.2-DOUT 24.2,5.6 v24.2,4.5 | LED60.4-DIN 28.8,2.4 v28.8,3.4
  Bottom 0.203: v24.2,4.5 24.7,4 28.2,4 v28.8,3.4
N$52  (via drill 0.3)
  Top 0.203: LED60.2-DOUT 33.2,5.6 v33.2,4.5 | LED61.4-DIN 37.8,2.4 v37.8,3.4
  Bottom 0.203: v33.2,4.5 33.7,4 37.2,4 v37.8,3.4
N$53  (via drill 0.3)
  Top 0.203: LED61.2-DOUT 42.2,5.6 v42.2,4.5 | LED62.4-DIN 46.8,2.4 v46.8,3.4
  Bottom 0.203: v42.2,4.5 42.7,4 46.2,4 v46.8,3.4
N$54  (via drill 0.3)
  Top 0.203: LED62.2-DOUT 51.2,5.6 v51.2,4.5 | LED63.4-DIN 55.8,2.4 v55.8,3.4
  Bottom 0.203: v51.2,4.5 51.7,4 55.2,4 v55.8,3.4
N$55  (via drill 0.3)
  Top 0.203: LED63.2-DOUT 60.2,5.6 v60.2,4.5 | LED64.4-DIN 64.8,2.4 v64.8,3.4
  Bottom 0.203: v60.2,4.5 60.7,4 64.2,4 v64.8,3.4
N$60  (via drill 0.3)
  Top 0.203: LED2.2-DOUT 15.2,68.6 v15.2,67.5 | LED3.4-DIN 19.8,65.4 v19.8,66.4
  Bottom 0.203: v15.2,67.5 15.7,67 19.2,67 v19.8,66.4
NET1  (via drill 0.3)
  Top 0.203: LED8.2-DOUT 69.2,68.6 v69.2,67.5 | LED9.4-DIN 1.8,56.4 v1.8,57.4
  Bottom 0.203: v1.8,57.4 2.4,58 3.8,58 5.95,60.15 12.5,60.15 13.25,61 62.6,60.9 v69.2,67.5
NET2  (via drill 0.3)
  Top 0.203: LED16.2-DOUT 69.2,59.6 v69.2,58.5 | LED17.4-DIN 1.8,47.4 v1.8,48.4
  Bottom 0.203: v69.2,58.5 62.6,51.9 55.5,51.9 54.7,51.1 52.3,51.1 51.5,51.9 19.5,51.9 18.7,51.1 5.9,51.1 3.8,49 2.4,49 v1.8,48.4
NET3  (via drill 0.3)
  Top 0.203: LED24.2-DOUT 69.2,50.6 v69.2,49.5 | LED25.4-DIN 1.8,38.4 v1.8,39.4
  Bottom 0.203: v69.2,49.5 62.6,42.9 6.7,42.9 3.7,39.9 2.4,39.9 v1.8,39.4
NET4  (via drill 0.3)
  Top 0.203: LED33.4-DIN 1.8,29.4 v1.8,30.4 | LED32.2-DOUT 69.2,41.6 v69.2,40.5
  Bottom 0.203: v1.8,30.4 2.4,31 3.8,31 6.7,33.9 62.6,33.9 v69.2,40.5
NET5  (via drill 0.3)
  Top 0.203: LED41.4-DIN 1.8,20.4 v1.8,21.4 | LED40.2-DOUT 69.2,32.6 v69.2,31.5
  Bottom 0.203: v1.8,21.4 2.4,22 3.8,22 6.7,24.9 62.6,24.9 v69.2,31.5
NET6  (via drill 0.3)
  Top 0.203: LED49.4-DIN 1.8,11.4 v1.8,12.4 | LED48.2-DOUT 69.2,23.6 v69.2,22.5
  Bottom 0.203: v1.8,12.4 2.4,13 3.8,13 5.9,15.1 18.7,15.1 19.5,15.9 51.5,15.9 52.3,15.1 54.7,15.1 55.5,15.9 62.6,15.9 v69.2,22.5
NET7  (via drill 0.3)
  Top 0.203: LED57.4-DIN 1.8,2.4 v1.8,3.4 | LED56.2-DOUT 69.2,14.6 v69.2,13.5
  Bottom 0.203: v1.8,3.4 2.4,4 3.8,4 6.7,6.9 53.2,6.9 57.7,11.4 67.1,11.4 v69.2,13.5
OUT  (via drill 0.3)
  Top 0.203: LED64.2-DOUT 69.25,5.35 69.2,5.3 v69.2,4.5
  Bottom 0.203: J2.I/O 60.5,6.6 61.4,5.7 68,5.7 v69.2,4.5

### Text on the board
tPlace: IN | ColorLED | Rev.1.0.1 | #404 | Designed in Aizu | OUT
bPlace: GND | 5V | DIN | INPUT | Designed in Aizu | #404 | ColorLED | OUTPUT | DOUT | 5V | GND